# Altium project SOM Board with RK3399.PrjPcb (part 4 of 4)
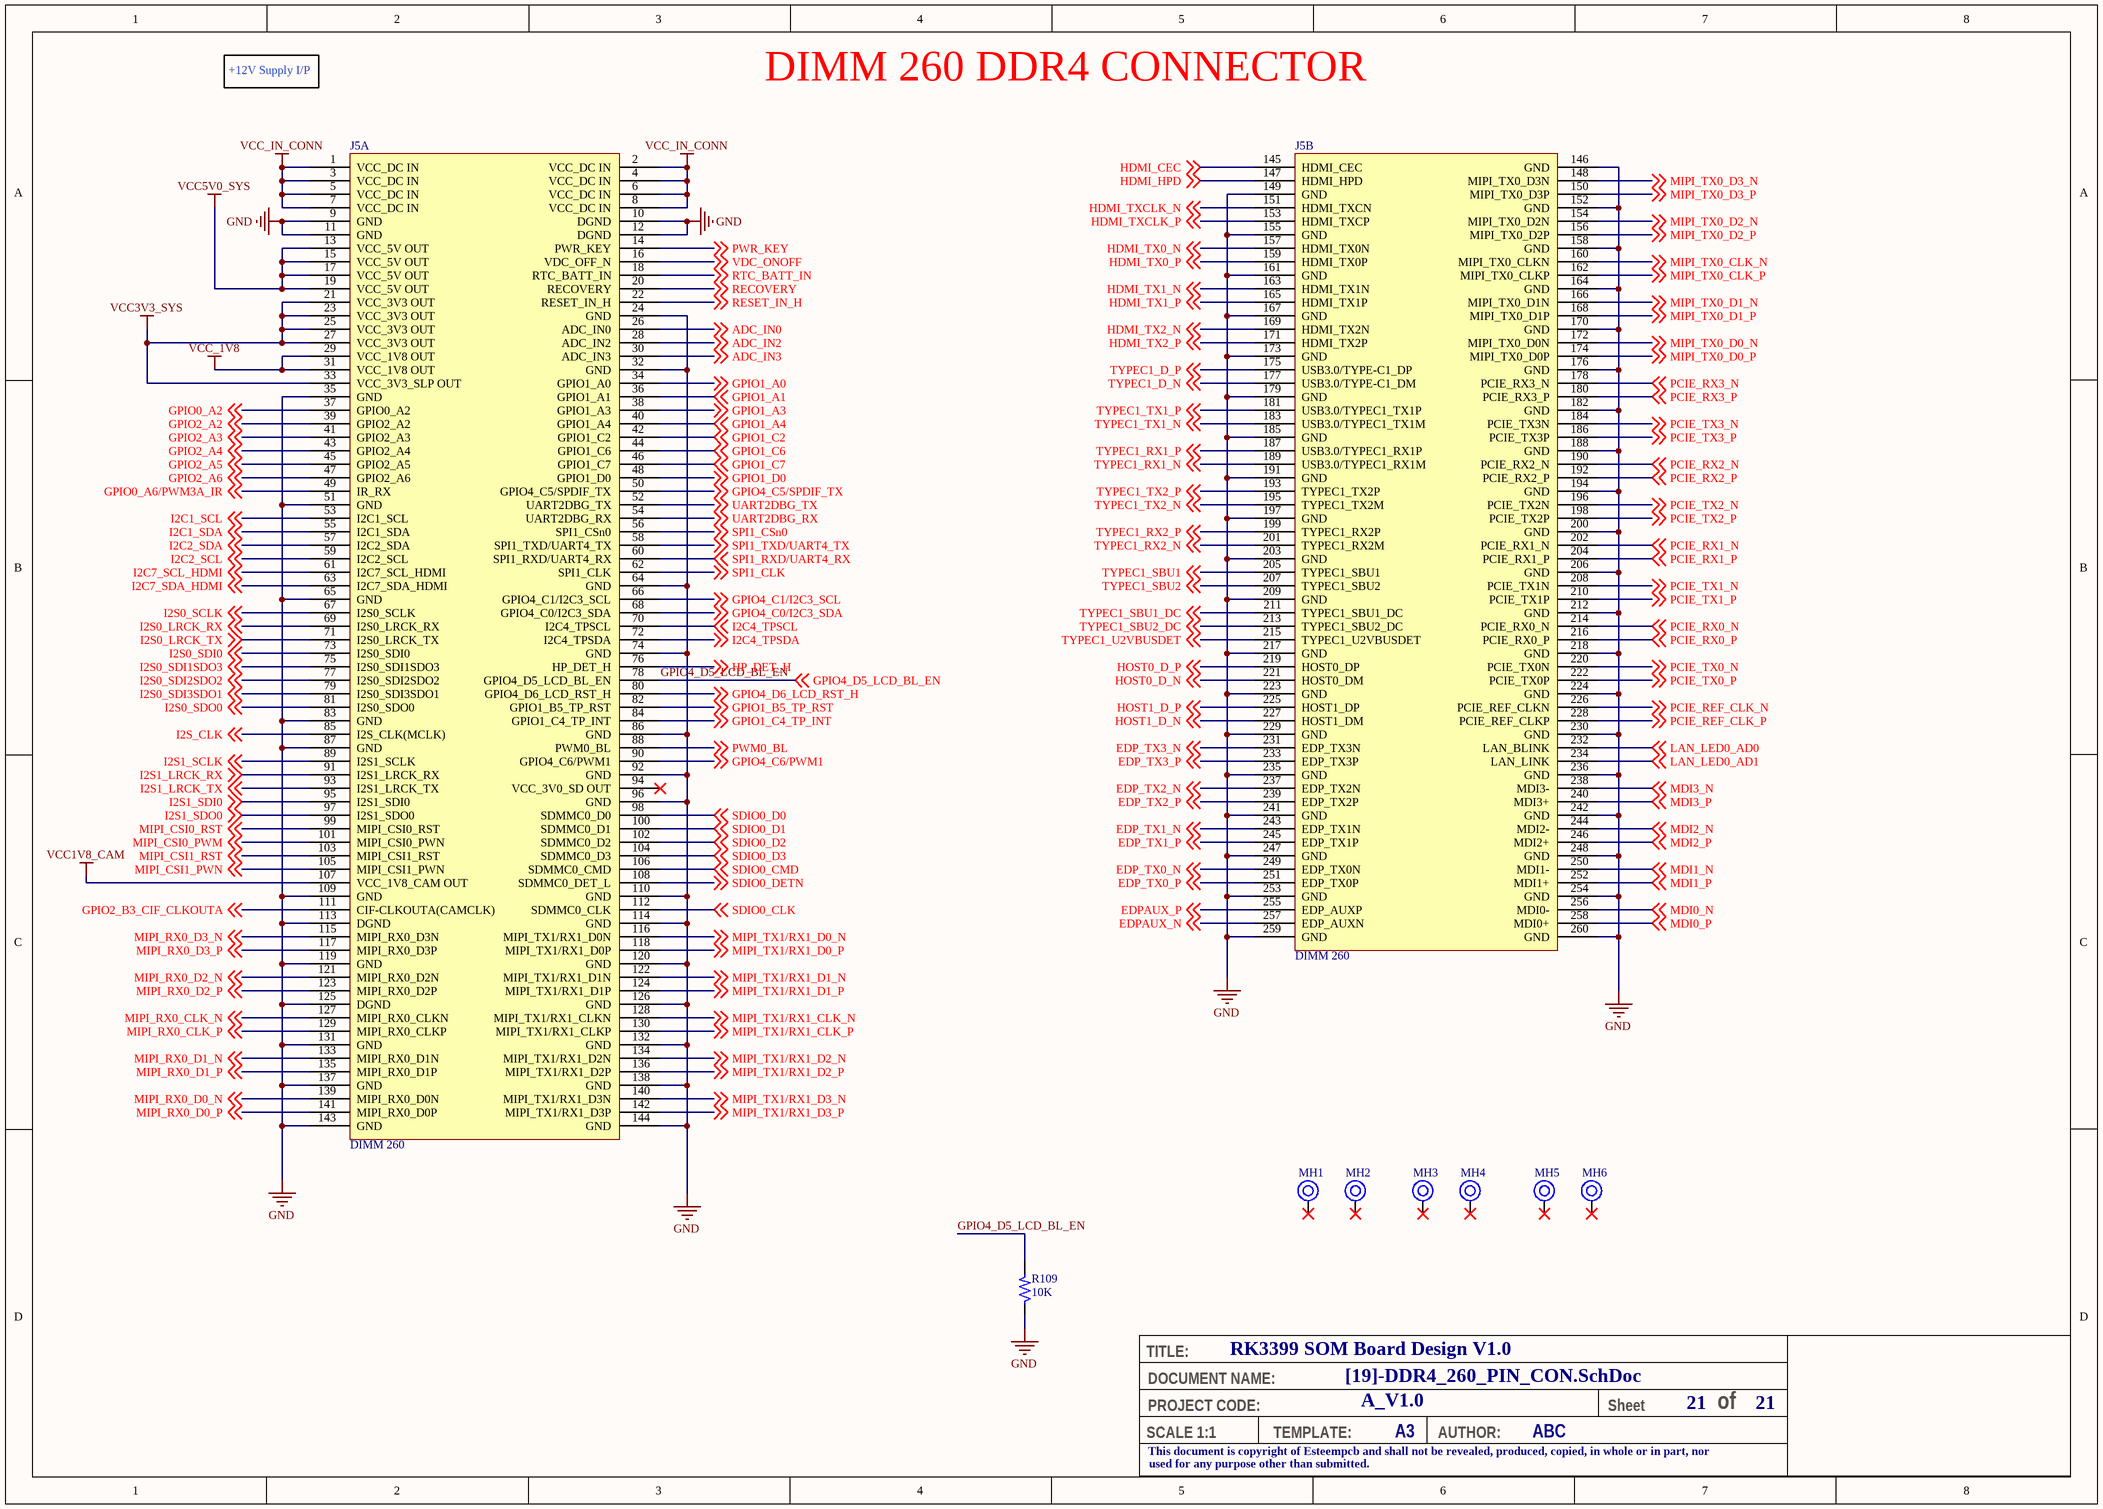
[diagram p21: [19]-DDR4_260_PIN_CON.SchDoc]

## Nets that join several sheets
GND: [1]-Power Pins Page of RK3399 (287 pins), [2]-PMUIO_BLOCK (14 pins), [3]-RK3399_EMMC_ADC_PCIE (9 pins), [4]-RK3399 EDP_CSI_HDMI (18 pins), [5]-USB2, TYPEC, USIC (17 pins), [6]-MIPI-CSI_GPIOs and I2C (6 pins), [7]-RGMII_SDIO_SPI_GPIOs etc (10 pins), [8]-RK3399 SDRAM Page (20 pins), [9]-LPDDR4 SDRAM-1 (104 pins), [10]-LPDDR4 SDRAM-2 (104 pins), [11]-EMMC Chip (19 pins), [12]-WIFI Module WF60 (29 pins), [13]-TYPEC0_PROG (23 pins), [14]-RGMII_PHY (29 pins), [15]-Push_Button_&_SYS_LED (Q6.2 SW2.1 SW3.1), [16]-SP1_TYPEC_PWR_IN (34 pins), [17]-SP2_BUCKs_GPU_LOG_CPU-B (45 pins), [18]-SP3_PMIC_BLOCK (57 pins), [19]-DDR4_260_PIN_CON (70 pins)
VCC1V8_CAM: [18]-SP3_PMIC_BLOCK (C284.2 U14.31), [19]-DDR4_260_PIN_CON (J5.107)
VCC3V3_S3: [5]-USB2, TYPEC, USIC (6 pins), [7]-RGMII_SDIO_SPI_GPIOs etc (C93.2 U1.J23), [11]-EMMC Chip (7 pins), [14]-RGMII_PHY (C335.2 C336.2 R110.1), [18]-SP3_PMIC_BLOCK (C292.2 U14.7)
VCC3V3_S5: [16]-SP1_TYPEC_PWR_IN (C327.2 C328.2 C329.2 U18.5), [18]-SP3_PMIC_BLOCK (8 pins)
VCC3V3_SYS: [2]-PMUIO_BLOCK (C257.2 U13.1), [12]-WIFI Module WF60 (5 pins), [13]-TYPEC0_PROG (C309.2 U15.4), [15]-Push_Button_&_SYS_LED (SW1.1), [16]-SP1_TYPEC_PWR_IN (5 pins), [17]-SP2_BUCKs_GPU_LOG_CPU-B (21 pins), [18]-SP3_PMIC_BLOCK (26 pins), [19]-DDR4_260_PIN_CON (5 pins)
VCC5V0_SYS: [12]-WIFI Module WF60 (C225.1 U8.1 U8.6), [13]-TYPEC0_PROG (5 pins), [15]-Push_Button_&_SYS_LED (R107.2), [16]-SP1_TYPEC_PWR_IN (5 pins), [19]-DDR4_260_PIN_CON (J5.13 J5.15 J5.17 J5.19)
VCC_0V9: [2]-PMUIO_BLOCK (FB8.1 U1.T24), [3]-RK3399_EMMC_ADC_PCIE (C56.2 C62.2 U1.L24 U1.W24), [4]-RK3399 EDP_CSI_HDMI (6 pins), [5]-USB2, TYPEC, USIC (8 pins), [8]-RK3399 SDRAM Page (FB2.2 FB3.2), [17]-SP2_BUCKs_GPU_LOG_CPU-B (C247.2 L4.2 R65.2)
VCC_1V5: [7]-RGMII_SDIO_SPI_GPIOs etc (C94.2 C98.2 U1.AC8 U1.N23), [18]-SP3_PMIC_BLOCK (C290.2 U14.2)
VCC_1V8: [2]-PMUIO_BLOCK (FB9.1 FB10.2), [3]-RK3399_EMMC_ADC_PCIE (5 pins), [4]-RK3399 EDP_CSI_HDMI (8 pins), [5]-USB2, TYPEC, USIC (6 pins), [6]-MIPI-CSI_GPIOs and I2C (12 pins), [7]-RGMII_SDIO_SPI_GPIOs etc (C92.2 C96.2 U1.AB8 U1.J22), [11]-EMMC Chip (9 pins), [17]-SP2_BUCKs_GPU_LOG_CPU-B (R60.2 R62.2 R67.1), [18]-SP3_PMIC_BLOCK (5 pins), [19]-DDR4_260_PIN_CON (J5.29 J5.31)
VCC_3V0: [7]-RGMII_SDIO_SPI_GPIOs etc (10 pins), [17]-SP2_BUCKs_GPU_LOG_CPU-B (R70.1), [18]-SP3_PMIC_BLOCK (C281.2 C291.2 U14.15 U14.17)
VCC_DDR: [8]-RK3399 SDRAM Page (44 pins), [9]-LPDDR4 SDRAM-1 (43 pins), [10]-LPDDR4 SDRAM-2 (43 pins), [18]-SP3_PMIC_BLOCK (5 pins)
VCC_DDRC: [9]-LPDDR4 SDRAM-1 (41 pins), [10]-LPDDR4 SDRAM-2 (41 pins), [18]-SP3_PMIC_BLOCK (C300.2 Q3.2)
VCC_IN_CONN: [16]-SP1_TYPEC_PWR_IN (10 pins), [18]-SP3_PMIC_BLOCK (C299.1), [19]-DDR4_260_PIN_CON (8 pins)
VCC_SDIO: [3]-RK3399_EMMC_ADC_PCIE (C58.2 U1.T23), [18]-SP3_PMIC_BLOCK (C288.2 U14.12)
VCCA1V8_CODEC: [7]-RGMII_SDIO_SPI_GPIOs etc (5 pins), [18]-SP3_PMIC_BLOCK (C287.2 U14.5)
VDD_CENTER: [1]-Power Pins Page of RK3399 (19 pins), [18]-SP3_PMIC_BLOCK (C266.2 C267.2 L6.1 U14.39)
VDD_CPU_B: [1]-Power Pins Page of RK3399 (24 pins), [17]-SP2_BUCKs_GPU_LOG_CPU-B (6 pins)
VDD_CPU_L: [1]-Power Pins Page of RK3399 (16 pins), [18]-SP3_PMIC_BLOCK (C270.2 C271.2 L8.1 U14.29)
VDD_GPU: [1]-Power Pins Page of RK3399 (37 pins), [17]-SP2_BUCKs_GPU_LOG_CPU-B (5 pins)
VDD_LOG: [1]-Power Pins Page of RK3399 (21 pins), [17]-SP2_BUCKs_GPU_LOG_CPU-B (C245.2 L3.2 R64.2)
ADC_IN0: [3]-RK3399_EMMC_ADC_PCIE (U1.AG26), [19]-DDR4_260_PIN_CON (J5.26)
ADC_IN2: [3]-RK3399_EMMC_ADC_PCIE (U1.AG25), [19]-DDR4_260_PIN_CON (J5.28)
ADC_IN3: [3]-RK3399_EMMC_ADC_PCIE (U1.AG28), [19]-DDR4_260_PIN_CON (J5.30)
CPU_B_SLEEP: [7]-RGMII_SDIO_SPI_GPIOs etc (U1.M27), [17]-SP2_BUCKs_GPU_LOG_CPU-B (U9.A1)
DDR0_A0: [8]-RK3399 SDRAM Page (U1.F2), [9]-LPDDR4 SDRAM-1 (U2.H2 U2.R2)
DDR0_A1: [8]-RK3399 SDRAM Page (U1.F1), [9]-LPDDR4 SDRAM-1 (U2.J2 U2.P2)
DDR0_A2: [8]-RK3399 SDRAM Page (U1.G1), [9]-LPDDR4 SDRAM-1 (U2.H9 U2.R9)
DDR0_A3: [8]-RK3399 SDRAM Page (U1.G2), [9]-LPDDR4 SDRAM-1 (U2.H10 U2.R10)
DDR0_A4: [8]-RK3399 SDRAM Page (U1.H2), [9]-LPDDR4 SDRAM-1 (U2.H11 U2.R11)
DDR0_A5: [8]-RK3399 SDRAM Page (U1.H1), [9]-LPDDR4 SDRAM-1 (U2.J11 U2.P11)
DDR0_CKE0: [8]-RK3399 SDRAM Page (U1.E1), [9]-LPDDR4 SDRAM-1 (U2.J4 U2.P4)
DDR0_CKE1: [8]-RK3399 SDRAM Page (U1.F5), [9]-LPDDR4 SDRAM-1 (U2.J5 U2.P5)
DDR0_CLK1_N: [8]-RK3399 SDRAM Page (U1.J5), [9]-LPDDR4 SDRAM-1 (U2.P9)
DDR0_CLK1_P: [8]-RK3399 SDRAM Page (U1.H5), [9]-LPDDR4 SDRAM-1 (U2.P8)
DDR0_CLK_N: [8]-RK3399 SDRAM Page (U1.J4), [9]-LPDDR4 SDRAM-1 (U2.J9)
DDR0_CLK_P: [8]-RK3399 SDRAM Page (U1.H4), [9]-LPDDR4 SDRAM-1 (U2.J8)
DDR0_CS0N: [8]-RK3399 SDRAM Page (U1.M6), [9]-LPDDR4 SDRAM-1 (U2.H4)
DDR0_CS1N: [8]-RK3399 SDRAM Page (U1.B1), [9]-LPDDR4 SDRAM-1 (U2.H3)
DDR0_CS2N: [8]-RK3399 SDRAM Page (U1.M5), [9]-LPDDR4 SDRAM-1 (U2.R4)
DDR0_CS3N: [8]-RK3399 SDRAM Page (U1.C2), [9]-LPDDR4 SDRAM-1 (U2.R3)
DDR0_D0: [8]-RK3399 SDRAM Page (U1.AB2), [9]-LPDDR4 SDRAM-1 (U2.B2)
DDR0_D1: [8]-RK3399 SDRAM Page (U1.AB1), [9]-LPDDR4 SDRAM-1 (U2.C2)
DDR0_D2: [8]-RK3399 SDRAM Page (U1.AA2), [9]-LPDDR4 SDRAM-1 (U2.E2)
DDR0_D3: [8]-RK3399 SDRAM Page (U1.AA1), [9]-LPDDR4 SDRAM-1 (U2.F2)
DDR0_D4: [8]-RK3399 SDRAM Page (U1.Y2), [9]-LPDDR4 SDRAM-1 (U2.F4)
DDR0_D5: [8]-RK3399 SDRAM Page (U1.Y1), [9]-LPDDR4 SDRAM-1 (U2.E4)
DDR0_D6: [8]-RK3399 SDRAM Page (U1.W1), [9]-LPDDR4 SDRAM-1 (U2.C4)
DDR0_D7: [8]-RK3399 SDRAM Page (U1.W2), [9]-LPDDR4 SDRAM-1 (U2.B4)
DDR0_D8: [8]-RK3399 SDRAM Page (U1.AF2), [9]-LPDDR4 SDRAM-1 (U2.B11)
DDR0_D9: [8]-RK3399 SDRAM Page (U1.AE2), [9]-LPDDR4 SDRAM-1 (U2.C11)
DDR0_D10: [8]-RK3399 SDRAM Page (U1.AF1), [9]-LPDDR4 SDRAM-1 (U2.E11)
DDR0_D11: [8]-RK3399 SDRAM Page (U1.AD2), [9]-LPDDR4 SDRAM-1 (U2.F11)
DDR0_D12: [8]-RK3399 SDRAM Page (U1.AE1), [9]-LPDDR4 SDRAM-1 (U2.F9)
DDR0_D13: [8]-RK3399 SDRAM Page (U1.AD1), [9]-LPDDR4 SDRAM-1 (U2.E9)
DDR0_D14: [8]-RK3399 SDRAM Page (U1.AC1), [9]-LPDDR4 SDRAM-1 (U2.C9)
DDR0_D15: [8]-RK3399 SDRAM Page (U1.AC2), [9]-LPDDR4 SDRAM-1 (U2.B9)
DDR0_D16: [8]-RK3399 SDRAM Page (U1.V1), [9]-LPDDR4 SDRAM-1 (U2.AA2)
DDR0_D17: [8]-RK3399 SDRAM Page (U1.V2), [9]-LPDDR4 SDRAM-1 (U2.Y2)
DDR0_D18: [8]-RK3399 SDRAM Page (U1.U1), [9]-LPDDR4 SDRAM-1 (U2.V2)
DDR0_D19: [8]-RK3399 SDRAM Page (U1.U2), [9]-LPDDR4 SDRAM-1 (U2.U2)
DDR0_D20: [8]-RK3399 SDRAM Page (U1.T1), [9]-LPDDR4 SDRAM-1 (U2.U4)
DDR0_D21: [8]-RK3399 SDRAM Page (U1.T2), [9]-LPDDR4 SDRAM-1 (U2.V4)
DDR0_D22: [8]-RK3399 SDRAM Page (U1.R2), [9]-LPDDR4 SDRAM-1 (U2.Y4)
DDR0_D23: [8]-RK3399 SDRAM Page (U1.R1), [9]-LPDDR4 SDRAM-1 (U2.AA4)
DDR0_D24: [8]-RK3399 SDRAM Page (U1.P1), [9]-LPDDR4 SDRAM-1 (U2.AA11)
DDR0_D25: [8]-RK3399 SDRAM Page (U1.P2), [9]-LPDDR4 SDRAM-1 (U2.Y11)
DDR0_D26: [8]-RK3399 SDRAM Page (U1.N1), [9]-LPDDR4 SDRAM-1 (U2.V11)
DDR0_D27: [8]-RK3399 SDRAM Page (U1.M1), [9]-LPDDR4 SDRAM-1 (U2.U11)
DDR0_D28: [8]-RK3399 SDRAM Page (U1.N2), [9]-LPDDR4 SDRAM-1 (U2.U9)
DDR0_D29: [8]-RK3399 SDRAM Page (U1.L1), [9]-LPDDR4 SDRAM-1 (U2.V9)
DDR0_D30: [8]-RK3399 SDRAM Page (U1.M2), [9]-LPDDR4 SDRAM-1 (U2.Y9)
DDR0_D31: [8]-RK3399 SDRAM Page (U1.L2), [9]-LPDDR4 SDRAM-1 (U2.AA9)
DDR0_DM0: [8]-RK3399 SDRAM Page (U1.Y5), [9]-LPDDR4 SDRAM-1 (U2.C3)
DDR0_DM1: [8]-RK3399 SDRAM Page (U1.AC5), [9]-LPDDR4 SDRAM-1 (U2.C10)
DDR0_DM2: [8]-RK3399 SDRAM Page (U1.U5), [9]-LPDDR4 SDRAM-1 (U2.Y3)
DDR0_DM3: [8]-RK3399 SDRAM Page (U1.P5), [9]-LPDDR4 SDRAM-1 (U2.Y10)
DDR0_DQS0_N: [8]-RK3399 SDRAM Page (U1.AA4), [9]-LPDDR4 SDRAM-1 (U2.E3)
DDR0_DQS0_P: [8]-RK3399 SDRAM Page (U1.Y4), [9]-LPDDR4 SDRAM-1 (U2.D3)
DDR0_DQS1_N: [8]-RK3399 SDRAM Page (U1.AD4), [9]-LPDDR4 SDRAM-1 (U2.E10)
DDR0_DQS1_P: [8]-RK3399 SDRAM Page (U1.AC4), [9]-LPDDR4 SDRAM-1 (U2.D10)
DDR0_DQS2_N: [8]-RK3399 SDRAM Page (U1.V4), [9]-LPDDR4 SDRAM-1 (U2.V3)
DDR0_DQS2_P: [8]-RK3399 SDRAM Page (U1.U4), [9]-LPDDR4 SDRAM-1 (U2.W3)
DDR0_DQS3_N: [8]-RK3399 SDRAM Page (U1.R4), [9]-LPDDR4 SDRAM-1 (U2.V10)
DDR0_DQS3_P: [8]-RK3399 SDRAM Page (U1.P4), [9]-LPDDR4 SDRAM-1 (U2.W10)
DDR0_RST: [8]-RK3399 SDRAM Page (U1.L7), [9]-LPDDR4 SDRAM-1 (U2.T11)
DDR1_A0: [8]-RK3399 SDRAM Page (U1.B10), [10]-LPDDR4 SDRAM-2 (U3.H2 U3.R2)
DDR1_A1: [8]-RK3399 SDRAM Page (U1.A10), [10]-LPDDR4 SDRAM-2 (U3.J2 U3.P2)
DDR1_A2: [8]-RK3399 SDRAM Page (U1.B9), [10]-LPDDR4 SDRAM-2 (U3.H9 U3.R9)
DDR1_A3: [8]-RK3399 SDRAM Page (U1.A9), [10]-LPDDR4 SDRAM-2 (U3.H10 U3.R10)
DDR1_A4: [8]-RK3399 SDRAM Page (U1.B8), [10]-LPDDR4 SDRAM-2 (U3.H11 U3.R11)
DDR1_A5: [8]-RK3399 SDRAM Page (U1.A8), [10]-LPDDR4 SDRAM-2 (U3.J11 U3.P11)
DDR1_CKE0: [8]-RK3399 SDRAM Page (U1.A5), [10]-LPDDR4 SDRAM-2 (U3.J4 U3.P4)
DDR1_CKE1: [8]-RK3399 SDRAM Page (U1.E6), [10]-LPDDR4 SDRAM-2 (U3.J5 U3.P5)
DDR1_CLK1_N: [8]-RK3399 SDRAM Page (U1.E8), [10]-LPDDR4 SDRAM-2 (U3.P9)
DDR1_CLK1_P: [8]-RK3399 SDRAM Page (U1.E9), [10]-LPDDR4 SDRAM-2 (U3.P8)
DDR1_CLK_N: [8]-RK3399 SDRAM Page (U1.D8), [10]-LPDDR4 SDRAM-2 (U3.J9)
DDR1_CLK_P: [8]-RK3399 SDRAM Page (U1.D9), [10]-LPDDR4 SDRAM-2 (U3.J8)
DDR1_CS0N: [8]-RK3399 SDRAM Page (U1.F12), [10]-LPDDR4 SDRAM-2 (U3.H4)
DDR1_CS1N: [8]-RK3399 SDRAM Page (U1.A2), [10]-LPDDR4 SDRAM-2 (U3.H3)
DDR1_CS2N: [8]-RK3399 SDRAM Page (U1.F11), [10]-LPDDR4 SDRAM-2 (U3.R4)
DDR1_CS3N: [8]-RK3399 SDRAM Page (U1.B3), [10]-LPDDR4 SDRAM-2 (U3.R3)
DDR1_D0: [8]-RK3399 SDRAM Page (U1.B15), [10]-LPDDR4 SDRAM-2 (U3.B2)
DDR1_D1: [8]-RK3399 SDRAM Page (U1.A15), [10]-LPDDR4 SDRAM-2 (U3.C2)
DDR1_D2: [8]-RK3399 SDRAM Page (U1.B16), [10]-LPDDR4 SDRAM-2 (U3.E2)
DDR1_D3: [8]-RK3399 SDRAM Page (U1.A16), [10]-LPDDR4 SDRAM-2 (U3.F2)
DDR1_D4: [8]-RK3399 SDRAM Page (U1.B17), [10]-LPDDR4 SDRAM-2 (U3.F4)
DDR1_D5: [8]-RK3399 SDRAM Page (U1.A17), [10]-LPDDR4 SDRAM-2 (U3.E4)
DDR1_D6: [8]-RK3399 SDRAM Page (U1.A18), [10]-LPDDR4 SDRAM-2 (U3.C4)
DDR1_D7: [8]-RK3399 SDRAM Page (U1.B18), [10]-LPDDR4 SDRAM-2 (U3.B4)
DDR1_D8: [8]-RK3399 SDRAM Page (U1.B11), [10]-LPDDR4 SDRAM-2 (U3.B11)
DDR1_D9: [8]-RK3399 SDRAM Page (U1.B12), [10]-LPDDR4 SDRAM-2 (U3.C11)
DDR1_D10: [8]-RK3399 SDRAM Page (U1.A11), [10]-LPDDR4 SDRAM-2 (U3.E11)
DDR1_D11: [8]-RK3399 SDRAM Page (U1.B13), [10]-LPDDR4 SDRAM-2 (U3.F11)
DDR1_D12: [8]-RK3399 SDRAM Page (U1.A12), [10]-LPDDR4 SDRAM-2 (U3.F9)
DDR1_D13: [8]-RK3399 SDRAM Page (U1.A13), [10]-LPDDR4 SDRAM-2 (U3.E9)
DDR1_D14: [8]-RK3399 SDRAM Page (U1.A14), [10]-LPDDR4 SDRAM-2 (U3.C9)
DDR1_D15: [8]-RK3399 SDRAM Page (U1.B14), [10]-LPDDR4 SDRAM-2 (U3.B9)
DDR1_D16: [8]-RK3399 SDRAM Page (U1.A19), [10]-LPDDR4 SDRAM-2 (U3.AA2)
DDR1_D17: [8]-RK3399 SDRAM Page (U1.B19), [10]-LPDDR4 SDRAM-2 (U3.Y2)
DDR1_D18: [8]-RK3399 SDRAM Page (U1.A20), [10]-LPDDR4 SDRAM-2 (U3.V2)
DDR1_D19: [8]-RK3399 SDRAM Page (U1.B20), [10]-LPDDR4 SDRAM-2 (U3.U2)
DDR1_D20: [8]-RK3399 SDRAM Page (U1.A21), [10]-LPDDR4 SDRAM-2 (U3.U4)
DDR1_D21: [8]-RK3399 SDRAM Page (U1.B21), [10]-LPDDR4 SDRAM-2 (U3.V4)
DDR1_D22: [8]-RK3399 SDRAM Page (U1.B22), [10]-LPDDR4 SDRAM-2 (U3.Y4)
DDR1_D23: [8]-RK3399 SDRAM Page (U1.A22), [10]-LPDDR4 SDRAM-2 (U3.AA4)
DDR1_D24: [8]-RK3399 SDRAM Page (U1.A23), [10]-LPDDR4 SDRAM-2 (U3.AA11)
DDR1_D25: [8]-RK3399 SDRAM Page (U1.B23), [10]-LPDDR4 SDRAM-2 (U3.Y11)
DDR1_D26: [8]-RK3399 SDRAM Page (U1.A24), [10]-LPDDR4 SDRAM-2 (U3.V11)
DDR1_D27: [8]-RK3399 SDRAM Page (U1.A25), [10]-LPDDR4 SDRAM-2 (U3.U11)
DDR1_D28: [8]-RK3399 SDRAM Page (U1.B24), [10]-LPDDR4 SDRAM-2 (U3.U9)
DDR1_D29: [8]-RK3399 SDRAM Page (U1.A26), [10]-LPDDR4 SDRAM-2 (U3.V9)
DDR1_D30: [8]-RK3399 SDRAM Page (U1.B25), [10]-LPDDR4 SDRAM-2 (U3.Y9)
DDR1_D31: [8]-RK3399 SDRAM Page (U1.B26), [10]-LPDDR4 SDRAM-2 (U3.AA9)
DDR1_DM0: [8]-RK3399 SDRAM Page (U1.E17), [10]-LPDDR4 SDRAM-2 (U3.C3)
DDR1_DM1: [8]-RK3399 SDRAM Page (U1.E14), [10]-LPDDR4 SDRAM-2 (U3.C10)
DDR1_DM2: [8]-RK3399 SDRAM Page (U1.E20), [10]-LPDDR4 SDRAM-2 (U3.Y3)
DDR1_DM3: [8]-RK3399 SDRAM Page (U1.E23), [10]-LPDDR4 SDRAM-2 (U3.Y10)
DDR1_DQS0_N: [8]-RK3399 SDRAM Page (U1.D17), [10]-LPDDR4 SDRAM-2 (U3.E3)
DDR1_DQS0_P: [8]-RK3399 SDRAM Page (U1.D18), [10]-LPDDR4 SDRAM-2 (U3.D3)
DDR1_DQS1_N: [8]-RK3399 SDRAM Page (U1.D14), [10]-LPDDR4 SDRAM-2 (U3.E10)
DDR1_DQS1_P: [8]-RK3399 SDRAM Page (U1.D15), [10]-LPDDR4 SDRAM-2 (U3.D10)
DDR1_DQS2_N: [8]-RK3399 SDRAM Page (U1.D20), [10]-LPDDR4 SDRAM-2 (U3.V3)
DDR1_DQS2_P: [8]-RK3399 SDRAM Page (U1.D21), [10]-LPDDR4 SDRAM-2 (U3.W3)
DDR1_DQS3_N: [8]-RK3399 SDRAM Page (U1.D23), [10]-LPDDR4 SDRAM-2 (U3.V10)
DDR1_DQS3_P: [8]-RK3399 SDRAM Page (U1.D24), [10]-LPDDR4 SDRAM-2 (U3.W10)
DDR1_RST: [8]-RK3399 SDRAM Page (U1.G11), [10]-LPDDR4 SDRAM-2 (U3.T11)
EDP_TX0_N: [4]-RK3399 EDP_CSI_HDMI (C65.1), [19]-DDR4_260_PIN_CON (J5.249)
EDP_TX0_P: [4]-RK3399 EDP_CSI_HDMI (C64.1), [19]-DDR4_260_PIN_CON (J5.251)
EDP_TX1_N: [4]-RK3399 EDP_CSI_HDMI (C67.1), [19]-DDR4_260_PIN_CON (J5.243)
EDP_TX1_P: [4]-RK3399 EDP_CSI_HDMI (C66.1), [19]-DDR4_260_PIN_CON (J5.245)
EDP_TX2_N: [4]-RK3399 EDP_CSI_HDMI (C69.1), [19]-DDR4_260_PIN_CON (J5.237)
EDP_TX2_P: [4]-RK3399 EDP_CSI_HDMI (C68.1), [19]-DDR4_260_PIN_CON (J5.239)
EDP_TX3_N: [4]-RK3399 EDP_CSI_HDMI (C71.1), [19]-DDR4_260_PIN_CON (J5.231)
EDP_TX3_P: [4]-RK3399 EDP_CSI_HDMI (C70.1), [19]-DDR4_260_PIN_CON (J5.233)
EDPAUX_N: [4]-RK3399 EDP_CSI_HDMI (U1.A28), [19]-DDR4_260_PIN_CON (J5.257)
EDPAUX_P: [4]-RK3399 EDP_CSI_HDMI (U1.B28), [19]-DDR4_260_PIN_CON (J5.255)
EFUSE_VQPS_EN_H: [2]-PMUIO_BLOCK (U13.3), [7]-RGMII_SDIO_SPI_GPIOs etc (U1.AK3)
EMMC_CLKO: [3]-RK3399_EMMC_ADC_PCIE (R1.2), [11]-EMMC Chip (U4.M5)
EMMC_CMD: [3]-RK3399_EMMC_ADC_PCIE (U1.J31), [11]-EMMC Chip (U4.M6)
EMMC_D0: [3]-RK3399_EMMC_ADC_PCIE (U1.J28), [11]-EMMC Chip (U4.A3)
EMMC_D1: [3]-RK3399_EMMC_ADC_PCIE (U1.J29), [11]-EMMC Chip (U4.A4)
EMMC_D2: [3]-RK3399_EMMC_ADC_PCIE (U1.J30), [11]-EMMC Chip (U4.A5)
EMMC_D3: [3]-RK3399_EMMC_ADC_PCIE (U1.J25), [11]-EMMC Chip (U4.B2)
EMMC_D4: [3]-RK3399_EMMC_ADC_PCIE (U1.J26), [11]-EMMC Chip (U4.B3)
EMMC_D5: [3]-RK3399_EMMC_ADC_PCIE (U1.J27), [11]-EMMC Chip (U4.B4)
EMMC_D6: [3]-RK3399_EMMC_ADC_PCIE (U1.L31), [11]-EMMC Chip (U4.B5)
EMMC_D7: [3]-RK3399_EMMC_ADC_PCIE (U1.K30), [11]-EMMC Chip (U4.B6)
EMMC_STRB: [3]-RK3399_EMMC_ADC_PCIE (U1.K31), [11]-EMMC Chip (U4.H5)
GPIO0_A2: [2]-PMUIO_BLOCK (U1.N24), [19]-DDR4_260_PIN_CON (J5.37)
GPIO0_A6/PWM3A_IR: [2]-PMUIO_BLOCK (U1.P25), [19]-DDR4_260_PIN_CON (J5.49)
GPIO0_B5/LED1_OUT: [2]-PMUIO_BLOCK (U1.P24), [15]-Push_Button_&_SYS_LED (R108.1)
GPIO1_A0: [7]-RGMII_SDIO_SPI_GPIOs etc (U1.R25), [19]-DDR4_260_PIN_CON (J5.34)
GPIO1_A1: [7]-RGMII_SDIO_SPI_GPIOs etc (U1.T31), [19]-DDR4_260_PIN_CON (J5.36)
GPIO1_A2_CC_INT_L: [7]-RGMII_SDIO_SPI_GPIOs etc (U1.R26), [13]-TYPEC0_PROG (U15.5)
GPIO1_A3: [7]-RGMII_SDIO_SPI_GPIOs etc (U1.R27), [19]-DDR4_260_PIN_CON (J5.38)
GPIO1_A4: [7]-RGMII_SDIO_SPI_GPIOs etc (U1.R28), [19]-DDR4_260_PIN_CON (J5.40)
GPIO1_B5_TP_RST: [7]-RGMII_SDIO_SPI_GPIOs etc (U1.M24), [19]-DDR4_260_PIN_CON (J5.82)
GPIO1_C2: [7]-RGMII_SDIO_SPI_GPIOs etc (U1.N31), [19]-DDR4_260_PIN_CON (J5.42)
GPIO1_C4_TP_INT: [7]-RGMII_SDIO_SPI_GPIOs etc (U1.M29), [19]-DDR4_260_PIN_CON (J5.84)
GPIO1_C6: [7]-RGMII_SDIO_SPI_GPIOs etc (U1.L25), [19]-DDR4_260_PIN_CON (J5.44)
GPIO1_C7: [7]-RGMII_SDIO_SPI_GPIOs etc (U1.M31), [19]-DDR4_260_PIN_CON (J5.46)
GPIO1_D0: [7]-RGMII_SDIO_SPI_GPIOs etc (U1.L26), [19]-DDR4_260_PIN_CON (J5.48)
GPIO2_A2: [6]-MIPI-CSI_GPIOs and I2C (U1.H30), [19]-DDR4_260_PIN_CON (J5.39)
GPIO2_A3: [6]-MIPI-CSI_GPIOs and I2C (U1.F28), [19]-DDR4_260_PIN_CON (J5.41)
GPIO2_A4: [6]-MIPI-CSI_GPIOs and I2C (U1.H29), [19]-DDR4_260_PIN_CON (J5.43)
GPIO2_A5: [6]-MIPI-CSI_GPIOs and I2C (U1.F29), [19]-DDR4_260_PIN_CON (J5.45)
GPIO2_A6: [6]-MIPI-CSI_GPIOs and I2C (U1.H27), [19]-DDR4_260_PIN_CON (J5.47)
GPIO2_B3_CIF_CLKOUTA: [6]-MIPI-CSI_GPIOs and I2C (U1.H31), [19]-DDR4_260_PIN_CON (J5.111)
GPIO4_C0/I2C3_SDA: [7]-RGMII_SDIO_SPI_GPIOs etc (U1.AG6), [19]-DDR4_260_PIN_CON (J5.68)
GPIO4_C1/I2C3_SCL: [7]-RGMII_SDIO_SPI_GPIOs etc (U1.AL2), [19]-DDR4_260_PIN_CON (J5.66)
GPIO4_C5/SPDIF_TX: [7]-RGMII_SDIO_SPI_GPIOs etc (U1.AK1), [19]-DDR4_260_PIN_CON (J5.50)
GPIO4_C6/PWM1: [7]-RGMII_SDIO_SPI_GPIOs etc (U1.AL3), [19]-DDR4_260_PIN_CON (J5.90)
GPIO4_D2: [7]-RGMII_SDIO_SPI_GPIOs etc (U1.AH3), [13]-TYPEC0_PROG (U16.4)
GPIO4_D5_LCD_BL_EN: [7]-RGMII_SDIO_SPI_GPIOs etc (U1.AJ3), [19]-DDR4_260_PIN_CON (J5.78 R109.2)
GPIO4_D6_LCD_RST_H: [7]-RGMII_SDIO_SPI_GPIOs etc (U1.AG4), [19]-DDR4_260_PIN_CON (J5.80)
GPU_SLEEP: [7]-RGMII_SDIO_SPI_GPIOs etc (U1.M25), [17]-SP2_BUCKs_GPU_LOG_CPU-B (U10.A1)
HDMI_CEC: [7]-RGMII_SDIO_SPI_GPIOs etc (U1.AD7), [19]-DDR4_260_PIN_CON (J5.145)
HDMI_HPD: [4]-RK3399 EDP_CSI_HDMI (D1.K R5.2 U1.AE15), [19]-DDR4_260_PIN_CON (J5.147)
HDMI_TX0_N: [4]-RK3399 EDP_CSI_HDMI (U1.AL17), [19]-DDR4_260_PIN_CON (J5.157)
HDMI_TX0_P: [4]-RK3399 EDP_CSI_HDMI (U1.AK17), [19]-DDR4_260_PIN_CON (J5.159)
HDMI_TX1_N: [4]-RK3399 EDP_CSI_HDMI (U1.AL18), [19]-DDR4_260_PIN_CON (J5.163)
HDMI_TX1_P: [4]-RK3399 EDP_CSI_HDMI (U1.AK18), [19]-DDR4_260_PIN_CON (J5.165)
HDMI_TX2_N: [4]-RK3399 EDP_CSI_HDMI (U1.AL19), [19]-DDR4_260_PIN_CON (J5.169)
HDMI_TX2_P: [4]-RK3399 EDP_CSI_HDMI (U1.AK19), [19]-DDR4_260_PIN_CON (J5.171)
HDMI_TXCLK_N: [4]-RK3399 EDP_CSI_HDMI (U1.AL16), [19]-DDR4_260_PIN_CON (J5.151)
HDMI_TXCLK_P: [4]-RK3399 EDP_CSI_HDMI (U1.AK16), [19]-DDR4_260_PIN_CON (J5.153)
HOST0_D_N: [5]-USB2, TYPEC, USIC (U1.AB31), [19]-DDR4_260_PIN_CON (J5.221)
HOST0_D_P: [5]-USB2, TYPEC, USIC (U1.AB30), [19]-DDR4_260_PIN_CON (J5.219)
HOST1_D_N: [5]-USB2, TYPEC, USIC (U1.AA31), [19]-DDR4_260_PIN_CON (J5.227)
HOST1_D_P: [5]-USB2, TYPEC, USIC (U1.AA30), [19]-DDR4_260_PIN_CON (J5.225)
HP_DET_H: [7]-RGMII_SDIO_SPI_GPIOs etc (U1.AH5), [19]-DDR4_260_PIN_CON (J5.76)
I2C1_SCL: [7]-RGMII_SDIO_SPI_GPIOs etc (R37.1 U1.Y6), [19]-DDR4_260_PIN_CON (J5.53)
I2C1_SDA: [7]-RGMII_SDIO_SPI_GPIOs etc (R36.1 U1.AG1), [19]-DDR4_260_PIN_CON (J5.55)
I2C2_SCL: [6]-MIPI-CSI_GPIOs and I2C (R18.1 U1.H25), [19]-DDR4_260_PIN_CON (J5.59)
I2C2_SDA: [6]-MIPI-CSI_GPIOs and I2C (R17.1 U1.G31), [19]-DDR4_260_PIN_CON (J5.57)
I2C4_TPSCL: [7]-RGMII_SDIO_SPI_GPIOs etc (R31.1 U1.P30), [13]-TYPEC0_PROG (U15.6), [19]-DDR4_260_PIN_CON (J5.70)
I2C4_TPSDA: [7]-RGMII_SDIO_SPI_GPIOs etc (R32.1 U1.P31), [13]-TYPEC0_PROG (U15.7), [19]-DDR4_260_PIN_CON (J5.72)
I2C7_SCL_HDMI: [6]-MIPI-CSI_GPIOs and I2C (R19.1 U1.H28), [19]-DDR4_260_PIN_CON (J5.61)
I2C7_SDA_HDMI: [6]-MIPI-CSI_GPIOs and I2C (R20.1 U1.G30), [19]-DDR4_260_PIN_CON (J5.63)
I2C_SCL_PMIC: [7]-RGMII_SDIO_SPI_GPIOs etc (R30.1 U1.N30), [17]-SP2_BUCKs_GPU_LOG_CPU-B (U9.A3 U10.A3), [18]-SP3_PMIC_BLOCK (U14.19)
I2C_SDA_PMIC: [7]-RGMII_SDIO_SPI_GPIOs etc (R33.1 U1.M26), [17]-SP2_BUCKs_GPU_LOG_CPU-B (U9.B1 U10.B1), [18]-SP3_PMIC_BLOCK (U14.18)
I2S0_LRCK_RX: [7]-RGMII_SDIO_SPI_GPIOs etc (U1.AF4), [19]-DDR4_260_PIN_CON (J5.69)
I2S0_LRCK_TX: [7]-RGMII_SDIO_SPI_GPIOs etc (U1.AJ2), [19]-DDR4_260_PIN_CON (J5.71)
I2S0_SCLK: [7]-RGMII_SDIO_SPI_GPIOs etc (U1.AG3), [19]-DDR4_260_PIN_CON (J5.67)
I2S0_SDI0: [7]-RGMII_SDIO_SPI_GPIOs etc (U1.Y7), [19]-DDR4_260_PIN_CON (J5.73)
I2S0_SDI1SDO3: [7]-RGMII_SDIO_SPI_GPIOs etc (U1.AE5), [19]-DDR4_260_PIN_CON (J5.75)
I2S0_SDI2SDO2: [7]-RGMII_SDIO_SPI_GPIOs etc (U1.AA6), [19]-DDR4_260_PIN_CON (J5.77)
I2S0_SDI3SDO1: [7]-RGMII_SDIO_SPI_GPIOs etc (U1.AH2), [19]-DDR4_260_PIN_CON (J5.79)
I2S0_SDO0: [7]-RGMII_SDIO_SPI_GPIOs etc (U1.AH1), [19]-DDR4_260_PIN_CON (J5.81)
I2S1_LRCK_RX: [7]-RGMII_SDIO_SPI_GPIOs etc (U1.AA7), [19]-DDR4_260_PIN_CON (J5.91)
I2S1_LRCK_TX: [7]-RGMII_SDIO_SPI_GPIOs etc (U1.AJ1), [19]-DDR4_260_PIN_CON (J5.93)
I2S1_SCLK: [7]-RGMII_SDIO_SPI_GPIOs etc (U1.AF3), [19]-DDR4_260_PIN_CON (J5.89)
I2S1_SDI0: [7]-RGMII_SDIO_SPI_GPIOs etc (U1.AD6), [19]-DDR4_260_PIN_CON (J5.95)
I2S1_SDO0: [7]-RGMII_SDIO_SPI_GPIOs etc (U1.AC6), [19]-DDR4_260_PIN_CON (J5.97)
I2S_CLK: [7]-RGMII_SDIO_SPI_GPIOs etc (U1.AC7), [19]-DDR4_260_PIN_CON (J5.85)
LAN_LED0_AD0: [14]-RGMII_PHY (R121.1 U20.34), [19]-DDR4_260_PIN_CON (J5.232)
LAN_LED0_AD1: [14]-RGMII_PHY (R122.2 U20.35), [19]-DDR4_260_PIN_CON (J5.234)
LOG_DVS_PWM: [7]-RGMII_SDIO_SPI_GPIOs etc (U1.M28), [17]-SP2_BUCKs_GPU_LOG_CPU-B (R68.1 R70.2)
MAC_COL: [7]-RGMII_SDIO_SPI_GPIOs etc (U1.D27), [14]-RGMII_PHY (R124.1 U20.33)
MAC_CRS: [7]-RGMII_SDIO_SPI_GPIOs etc (U1.B27), [14]-RGMII_PHY (C345.2 R116.1 U20.29)
MAC_MCLK: [7]-RGMII_SDIO_SPI_GPIOs etc (R27.2), [14]-RGMII_PHY (R117.1)
MAC_MDC: [7]-RGMII_SDIO_SPI_GPIOs etc (U1.E29), [14]-RGMII_PHY (U20.30)
MAC_MDIO: [7]-RGMII_SDIO_SPI_GPIOs etc (U1.G26), [14]-RGMII_PHY (R114.1 U20.31)
MAC_RXCLK: [7]-RGMII_SDIO_SPI_GPIOs etc (U1.F25), [14]-RGMII_PHY (R119.1)
MAC_RXD0: [7]-RGMII_SDIO_SPI_GPIOs etc (U1.E26), [14]-RGMII_PHY (R129.1 U20.14)
MAC_RXD1: [7]-RGMII_SDIO_SPI_GPIOs etc (U1.F27), [14]-RGMII_PHY (R125.2 R126.1 U20.16)
MAC_RXD2: [7]-RGMII_SDIO_SPI_GPIOs etc (U1.E30), [14]-RGMII_PHY (R130.1 U20.17)
MAC_RXD3: [7]-RGMII_SDIO_SPI_GPIOs etc (U1.E25), [14]-RGMII_PHY (R131.1 U20.18)
MAC_RXDV: [7]-RGMII_SDIO_SPI_GPIOs etc (U1.C27), [14]-RGMII_PHY (R123.2 U20.13)
MAC_RXER: [7]-RGMII_SDIO_SPI_GPIOs etc (U1.F23), [14]-RGMII_PHY (R115.1 U20.20)
MAC_TXCLK: [7]-RGMII_SDIO_SPI_GPIOs etc (R29.2), [14]-RGMII_PHY (R120.1)
MAC_TXD0: [7]-RGMII_SDIO_SPI_GPIOs etc (R25.2), [14]-RGMII_PHY (U20.23)
MAC_TXD1: [7]-RGMII_SDIO_SPI_GPIOs etc (R26.2), [14]-RGMII_PHY (U20.24)
MAC_TXD2: [7]-RGMII_SDIO_SPI_GPIOs etc (R23.2), [14]-RGMII_PHY (U20.25)
MAC_TXD3: [7]-RGMII_SDIO_SPI_GPIOs etc (R24.2), [14]-RGMII_PHY (U20.26)
MAC_TXEN: [7]-RGMII_SDIO_SPI_GPIOs etc (R28.2), [14]-RGMII_PHY (U20.27)
MDI0_N: [14]-RGMII_PHY (U20.2), [19]-DDR4_260_PIN_CON (J5.256)
MDI0_P: [14]-RGMII_PHY (U20.1), [19]-DDR4_260_PIN_CON (J5.258)
MDI1_N: [14]-RGMII_PHY (U20.5), [19]-DDR4_260_PIN_CON (J5.250)
MDI1_P: [14]-RGMII_PHY (U20.4), [19]-DDR4_260_PIN_CON (J5.252)
MDI2_N: [14]-RGMII_PHY (U20.8), [19]-DDR4_260_PIN_CON (J5.244)
MDI2_P: [14]-RGMII_PHY (U20.7), [19]-DDR4_260_PIN_CON (J5.246)
MDI3_N: [14]-RGMII_PHY (U20.11), [19]-DDR4_260_PIN_CON (J5.238)
MDI3_P: [14]-RGMII_PHY (U20.10), [19]-DDR4_260_PIN_CON (J5.240)
MIPI_CSI0_PWM: [7]-RGMII_SDIO_SPI_GPIOs etc (U1.AF8), [19]-DDR4_260_PIN_CON (J5.101)
MIPI_CSI0_RST: [7]-RGMII_SDIO_SPI_GPIOs etc (U1.AD9), [19]-DDR4_260_PIN_CON (J5.99)
MIPI_CSI1_PWN: [2]-PMUIO_BLOCK (U1.V26), [19]-DDR4_260_PIN_CON (J5.105)
MIPI_CSI1_RST: [2]-PMUIO_BLOCK (U1.U28), [19]-DDR4_260_PIN_CON (J5.103)
MIPI_RX0_CLK_N: [6]-MIPI-CSI_GPIOs and I2C (U1.AL13), [19]-DDR4_260_PIN_CON (J5.127)
MIPI_RX0_CLK_P: [6]-MIPI-CSI_GPIOs and I2C (U1.AK13), [19]-DDR4_260_PIN_CON (J5.129)
MIPI_RX0_D0_N: [6]-MIPI-CSI_GPIOs and I2C (U1.AL15), [19]-DDR4_260_PIN_CON (J5.139)
MIPI_RX0_D0_P: [6]-MIPI-CSI_GPIOs and I2C (U1.AK15), [19]-DDR4_260_PIN_CON (J5.141)
MIPI_RX0_D1_N: [6]-MIPI-CSI_GPIOs and I2C (U1.AL14), [19]-DDR4_260_PIN_CON (J5.133)
MIPI_RX0_D1_P: [6]-MIPI-CSI_GPIOs and I2C (U1.AK14), [19]-DDR4_260_PIN_CON (J5.135)
MIPI_RX0_D2_N: [6]-MIPI-CSI_GPIOs and I2C (U1.AL12), [19]-DDR4_260_PIN_CON (J5.121)
MIPI_RX0_D2_P: [6]-MIPI-CSI_GPIOs and I2C (U1.AK12), [19]-DDR4_260_PIN_CON (J5.123)
MIPI_RX0_D3_N: [6]-MIPI-CSI_GPIOs and I2C (U1.AL11), [19]-DDR4_260_PIN_CON (J5.115)
MIPI_RX0_D3_P: [6]-MIPI-CSI_GPIOs and I2C (U1.AK11), [19]-DDR4_260_PIN_CON (J5.117)
MIPI_TX0_CLK_N: [4]-RK3399 EDP_CSI_HDMI (U1.AH12), [19]-DDR4_260_PIN_CON (J5.160)
MIPI_TX0_CLK_P: [4]-RK3399 EDP_CSI_HDMI (U1.AG12), [19]-DDR4_260_PIN_CON (J5.162)
MIPI_TX0_D0_N: [4]-RK3399 EDP_CSI_HDMI (U1.AH15), [19]-DDR4_260_PIN_CON (J5.172)
MIPI_TX0_D0_P: [4]-RK3399 EDP_CSI_HDMI (U1.AG15), [19]-DDR4_260_PIN_CON (J5.174)
MIPI_TX0_D1_N: [4]-RK3399 EDP_CSI_HDMI (U1.AH14), [19]-DDR4_260_PIN_CON (J5.166)
MIPI_TX0_D1_P: [4]-RK3399 EDP_CSI_HDMI (U1.AG14), [19]-DDR4_260_PIN_CON (J5.168)
MIPI_TX0_D2_N: [4]-RK3399 EDP_CSI_HDMI (U1.AH11), [19]-DDR4_260_PIN_CON (J5.154)
MIPI_TX0_D2_P: [4]-RK3399 EDP_CSI_HDMI (U1.AG11), [19]-DDR4_260_PIN_CON (J5.156)
MIPI_TX0_D3_N: [4]-RK3399 EDP_CSI_HDMI (U1.AH9), [19]-DDR4_260_PIN_CON (J5.148)
MIPI_TX0_D3_P: [4]-RK3399 EDP_CSI_HDMI (U1.AG9), [19]-DDR4_260_PIN_CON (J5.150)
MIPI_TX1/RX1_CLK_N: [6]-MIPI-CSI_GPIOs and I2C (U1.AL8), [19]-DDR4_260_PIN_CON (J5.128)
MIPI_TX1/RX1_CLK_P: [6]-MIPI-CSI_GPIOs and I2C (U1.AK8), [19]-DDR4_260_PIN_CON (J5.130)
MIPI_TX1/RX1_D0_N: [6]-MIPI-CSI_GPIOs and I2C (U1.AL6), [19]-DDR4_260_PIN_CON (J5.116)
MIPI_TX1/RX1_D0_P: [6]-MIPI-CSI_GPIOs and I2C (U1.AK6), [19]-DDR4_260_PIN_CON (J5.118)
MIPI_TX1/RX1_D1_N: [6]-MIPI-CSI_GPIOs and I2C (U1.AL7), [19]-DDR4_260_PIN_CON (J5.122)
MIPI_TX1/RX1_D1_P: [6]-MIPI-CSI_GPIOs and I2C (U1.AK7), [19]-DDR4_260_PIN_CON (J5.124)
MIPI_TX1/RX1_D2_N: [6]-MIPI-CSI_GPIOs and I2C (U1.AL9), [19]-DDR4_260_PIN_CON (J5.134)
MIPI_TX1/RX1_D2_P: [6]-MIPI-CSI_GPIOs and I2C (U1.AK9), [19]-DDR4_260_PIN_CON (J5.136)
MIPI_TX1/RX1_D3_N: [6]-MIPI-CSI_GPIOs and I2C (U1.AL10), [19]-DDR4_260_PIN_CON (J5.140)
MIPI_TX1/RX1_D3_P: [6]-MIPI-CSI_GPIOs and I2C (U1.AK10), [19]-DDR4_260_PIN_CON (J5.142)
OTP_OUT_H: [7]-RGMII_SDIO_SPI_GPIOs etc (U1.P26), [17]-SP2_BUCKs_GPU_LOG_CPU-B (R74.2)
PCIE_REF_CLK_N: [3]-RK3399_EMMC_ADC_PCIE (U1.AD30), [19]-DDR4_260_PIN_CON (J5.226)
PCIE_REF_CLK_P: [3]-RK3399_EMMC_ADC_PCIE (U1.AD31), [19]-DDR4_260_PIN_CON (J5.228)
PCIE_RX0_N: [3]-RK3399_EMMC_ADC_PCIE (U1.AF31), [19]-DDR4_260_PIN_CON (J5.214)
PCIE_RX0_P: [3]-RK3399_EMMC_ADC_PCIE (U1.AF30), [19]-DDR4_260_PIN_CON (J5.216)
PCIE_RX1_N: [3]-RK3399_EMMC_ADC_PCIE (U1.AH31), [19]-DDR4_260_PIN_CON (J5.202)
PCIE_RX1_P: [3]-RK3399_EMMC_ADC_PCIE (U1.AH30), [19]-DDR4_260_PIN_CON (J5.204)
PCIE_RX2_N: [3]-RK3399_EMMC_ADC_PCIE (U1.AC28), [19]-DDR4_260_PIN_CON (J5.190)
PCIE_RX2_P: [3]-RK3399_EMMC_ADC_PCIE (U1.AC27), [19]-DDR4_260_PIN_CON (J5.192)
PCIE_RX3_N: [3]-RK3399_EMMC_ADC_PCIE (U1.AF28), [19]-DDR4_260_PIN_CON (J5.178)
PCIE_RX3_P: [3]-RK3399_EMMC_ADC_PCIE (U1.AF27), [19]-DDR4_260_PIN_CON (J5.180)
PCIE_TX0_N: [3]-RK3399_EMMC_ADC_PCIE (U1.AE31), [19]-DDR4_260_PIN_CON (J5.220)
PCIE_TX0_P: [3]-RK3399_EMMC_ADC_PCIE (U1.AE30), [19]-DDR4_260_PIN_CON (J5.222)
PCIE_TX1_N: [3]-RK3399_EMMC_ADC_PCIE (U1.AG31), [19]-DDR4_260_PIN_CON (J5.208)
PCIE_TX1_P: [3]-RK3399_EMMC_ADC_PCIE (U1.AG30), [19]-DDR4_260_PIN_CON (J5.210)
PCIE_TX2_N: [3]-RK3399_EMMC_ADC_PCIE (U1.AA28), [19]-DDR4_260_PIN_CON (J5.196)
PCIE_TX2_P: [3]-RK3399_EMMC_ADC_PCIE (U1.AA27), [19]-DDR4_260_PIN_CON (J5.198)
PCIE_TX3_N: [3]-RK3399_EMMC_ADC_PCIE (U1.AD28), [19]-DDR4_260_PIN_CON (J5.184)
PCIE_TX3_P: [3]-RK3399_EMMC_ADC_PCIE (U1.AD27), [19]-DDR4_260_PIN_CON (J5.186)
PMIC_EXT_EN: [16]-SP1_TYPEC_PWR_IN (R101.2 U19.8), [17]-SP2_BUCKs_GPU_LOG_CPU-B (U12.2), [18]-SP3_PMIC_BLOCK (U14.55)
PMIC_INT_L: [7]-RGMII_SDIO_SPI_GPIOs etc (U1.M30), [18]-SP3_PMIC_BLOCK (C297.2 U14.49)
PMIC_SLEEP_H: [7]-RGMII_SDIO_SPI_GPIOs etc (U1.R30), [18]-SP3_PMIC_BLOCK (C298.2 Q4.1 U14.50)
PWM0_BL: [7]-RGMII_SDIO_SPI_GPIOs etc (U1.AF5), [19]-DDR4_260_PIN_CON (J5.88)
PWR_KEY: [15]-Push_Button_&_SYS_LED (SW3.2), [18]-SP3_PMIC_BLOCK (R86.1), [19]-DDR4_260_PIN_CON (J5.14)
PWR_KEY_L: [2]-PMUIO_BLOCK (U1.V27), [18]-SP3_PMIC_BLOCK (D5.A)
RECOVERY: [3]-RK3399_EMMC_ADC_PCIE (R4.2), [15]-Push_Button_&_SYS_LED (SW2.2), [19]-DDR4_260_PIN_CON (J5.20)
RESET_IN_H: [15]-Push_Button_&_SYS_LED (SW1.2), [17]-SP2_BUCKs_GPU_LOG_CPU-B (Q1.3), [18]-SP3_PMIC_BLOCK (C296.2 U14.6), [19]-DDR4_260_PIN_CON (J5.22)
RESET_L: [2]-PMUIO_BLOCK (R76.1), [18]-SP3_PMIC_BLOCK (R84.1 U14.20)
RTC_BATT_IN: [18]-SP3_PMIC_BLOCK (D4.A1), [19]-DDR4_260_PIN_CON (J5.18)
RTC_CLKO_SOC: [2]-PMUIO_BLOCK (U1.U31), [18]-SP3_PMIC_BLOCK (R82.1 U14.68)
SDIO0_CLK: [7]-RGMII_SDIO_SPI_GPIOs etc (U1.AF7), [19]-DDR4_260_PIN_CON (J5.112)
SDIO0_CMD: [7]-RGMII_SDIO_SPI_GPIOs etc (U1.AH6), [19]-DDR4_260_PIN_CON (J5.106)
SDIO0_D0: [7]-RGMII_SDIO_SPI_GPIOs etc (U1.AD8), [19]-DDR4_260_PIN_CON (J5.98)
SDIO0_D1: [7]-RGMII_SDIO_SPI_GPIOs etc (U1.AK5), [19]-DDR4_260_PIN_CON (J5.100)
SDIO0_D2: [7]-RGMII_SDIO_SPI_GPIOs etc (U1.AG7), [19]-DDR4_260_PIN_CON (J5.102)
SDIO0_D3: [7]-RGMII_SDIO_SPI_GPIOs etc (U1.AE8), [19]-DDR4_260_PIN_CON (J5.104)
SDIO0_DETN: [7]-RGMII_SDIO_SPI_GPIOs etc (U1.AL4), [19]-DDR4_260_PIN_CON (J5.108)
SDMMC0_CLK: [3]-RK3399_EMMC_ADC_PCIE (R2.2), [12]-WIFI Module WF60 (U6.E1)
SDMMC0_CMD: [3]-RK3399_EMMC_ADC_PCIE (U1.V25), [12]-WIFI Module WF60 (U6.A2)
SDMMC0_D0: [3]-RK3399_EMMC_ADC_PCIE (U1.Y27), [12]-WIFI Module WF60 (U6.A1)
SDMMC0_D1: [3]-RK3399_EMMC_ADC_PCIE (U1.Y26), [12]-WIFI Module WF60 (U6.B2)
SDMMC0_D2: [3]-RK3399_EMMC_ADC_PCIE (U1.Y28), [12]-WIFI Module WF60 (U6.B1)
SDMMC0_D3: [3]-RK3399_EMMC_ADC_PCIE (U1.U27), [12]-WIFI Module WF60 (U6.C2)
SDMMC0_DET_L: [2]-PMUIO_BLOCK (U1.V28), [12]-WIFI Module WF60 (R53.2)
SPI1_CLK: [7]-RGMII_SDIO_SPI_GPIOs etc (U1.P28), [19]-DDR4_260_PIN_CON (J5.62)
SPI1_CSn0: [7]-RGMII_SDIO_SPI_GPIOs etc (U1.P29), [19]-DDR4_260_PIN_CON (J5.56)
SPI1_RXD/UART4_RX: [7]-RGMII_SDIO_SPI_GPIOs etc (U1.P27), [19]-DDR4_260_PIN_CON (J5.60)
SPI1_TXD/UART4_TX: [7]-RGMII_SDIO_SPI_GPIOs etc (U1.R31), [19]-DDR4_260_PIN_CON (J5.58)
TYPEC0_D_N: [5]-USB2, TYPEC, USIC (U1.AH23), [13]-TYPEC0_PROG (J3.A7 J3.B7)
TYPEC0_D_P: [5]-USB2, TYPEC, USIC (U1.AG23), [13]-TYPEC0_PROG (J3.A6 J3.B6)
TYPEC0_RX1_N: [5]-USB2, TYPEC, USIC (U1.AL21), [13]-TYPEC0_PROG (J3.B10)
TYPEC0_RX1_P: [5]-USB2, TYPEC, USIC (U1.AK21), [13]-TYPEC0_PROG (J3.B11)
TYPEC0_RX2_N: [5]-USB2, TYPEC, USIC (U1.AL23), [13]-TYPEC0_PROG (J3.A10)
TYPEC0_RX2_P: [5]-USB2, TYPEC, USIC (U1.AK23), [13]-TYPEC0_PROG (J3.A11)
TYPEC0_SBU1_DC_N: [5]-USB2, TYPEC, USIC (U1.AG17), [13]-TYPEC0_PROG (R91.1)
TYPEC0_SBU1_DC_P: [5]-USB2, TYPEC, USIC (U1.AH17), [13]-TYPEC0_PROG (R94.1)
TYPEC0_SBU1_N: [5]-USB2, TYPEC, USIC (U1.AL20), [13]-TYPEC0_PROG (C305.1)
TYPEC0_SBU1_P: [5]-USB2, TYPEC, USIC (U1.AK20), [13]-TYPEC0_PROG (C304.1)
TYPEC0_TX1_N: [5]-USB2, TYPEC, USIC (U1.AK22), [13]-TYPEC0_PROG (C306.1)
TYPEC0_TX1_P: [5]-USB2, TYPEC, USIC (U1.AL22), [13]-TYPEC0_PROG (C307.1)
TYPEC0_TX2_N: [5]-USB2, TYPEC, USIC (U1.AK24), [13]-TYPEC0_PROG (C308.1)
TYPEC0_TX2_P: [5]-USB2, TYPEC, USIC (U1.AL24), [13]-TYPEC0_PROG (C312.1)
TYPEC0_U2VBUSDET: [5]-USB2, TYPEC, USIC (R9.2), [13]-TYPEC0_PROG (D7.K R90.1)
TYPEC1_D_N: [5]-USB2, TYPEC, USIC (U1.AH24), [19]-DDR4_260_PIN_CON (J5.177)
TYPEC1_D_P: [5]-USB2, TYPEC, USIC (U1.AG24), [19]-DDR4_260_PIN_CON (J5.175)
TYPEC1_RX1_N: [5]-USB2, TYPEC, USIC (U1.AL25), [19]-DDR4_260_PIN_CON (J5.189)
TYPEC1_RX1_P: [5]-USB2, TYPEC, USIC (U1.AK25), [19]-DDR4_260_PIN_CON (J5.187)
TYPEC1_RX2_N: [5]-USB2, TYPEC, USIC (U1.AL27), [19]-DDR4_260_PIN_CON (J5.201)
TYPEC1_RX2_P: [5]-USB2, TYPEC, USIC (U1.AK27), [19]-DDR4_260_PIN_CON (J5.199)
TYPEC1_SBU1: [5]-USB2, TYPEC, USIC (U1.AK29), [19]-DDR4_260_PIN_CON (J5.205)
TYPEC1_SBU1_DC: [5]-USB2, TYPEC, USIC (U1.AE24), [19]-DDR4_260_PIN_CON (J5.211)
TYPEC1_SBU2: [5]-USB2, TYPEC, USIC (U1.AL29), [19]-DDR4_260_PIN_CON (J5.207)
TYPEC1_SBU2_DC: [5]-USB2, TYPEC, USIC (U1.AF25), [19]-DDR4_260_PIN_CON (J5.213)
TYPEC1_TX1_N: [5]-USB2, TYPEC, USIC (U1.AK26), [19]-DDR4_260_PIN_CON (J5.183)
TYPEC1_TX1_P: [5]-USB2, TYPEC, USIC (U1.AL26), [19]-DDR4_260_PIN_CON (J5.181)
TYPEC1_TX2_N: [5]-USB2, TYPEC, USIC (U1.AK28), [19]-DDR4_260_PIN_CON (J5.195)
TYPEC1_TX2_P: [5]-USB2, TYPEC, USIC (U1.AL28), [19]-DDR4_260_PIN_CON (J5.193)
TYPEC1_U2VBUSDET: [5]-USB2, TYPEC, USIC (R11.2), [19]-DDR4_260_PIN_CON (J5.215)
UART2DBG_RX: [7]-RGMII_SDIO_SPI_GPIOs etc (U1.AK2), [19]-DDR4_260_PIN_CON (J5.54)
UART2DBG_TX: [7]-RGMII_SDIO_SPI_GPIOs etc (U1.AJ4), [19]-DDR4_260_PIN_CON (J5.52)
VDC_ONOFF: [18]-SP3_PMIC_BLOCK (R85.2), [19]-DDR4_260_PIN_CON (J5.16)
VDD_CPU_B_FB: [1]-Power Pins Page of RK3399 (U1.N18), [17]-SP2_BUCKs_GPU_LOG_CPU-B (R61.1 U9.A4)
VDD_GPU_FB: [1]-Power Pins Page of RK3399 (U1.T15), [17]-SP2_BUCKs_GPU_LOG_CPU-B (R63.2 U10.A4)